# Altium schematic sheet Sheet1.SchDoc
size A
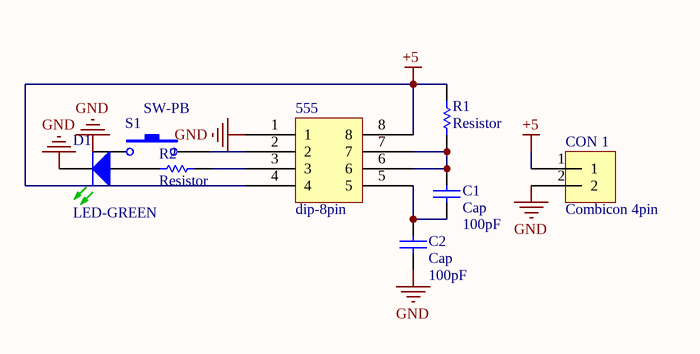
[diagram p0: Sheet1.SchDoc]

## Parts
555  dip-8pin  [dip-8pin]
C1  Cap  value 100pF  [CAP]
C2  Cap  value 100pF  [CAP]
CON_1  Combicon 4pin  [combicon-2pin_black]
D1  LED-GREEN  [LED-GREEN]
R1  Resistor  [res-2.54x4]
R2  Resistor  [res-2.54x5]
S1  SW-PB  [sw-pb]

## Nets
+5: 555.4 555.8 CON_1.1 R1.2  [also labelled +5 ]
GND: 555.1 C2.2 CON_1.2 D1.2(K) S1.1
Net555_2: 555.2 S1.2
Net555_3: 555.3 R2.2
Net555_5: 555.5 C1.1 C2.1
Net555_6: 555.6 555.7 C1.2 R1.1
NetD1_1: D1.1(A) R2.1

## Library data of the parts
C1 C2 = Cap: Capacitor; Published: 8-Jun-2000; LatestRevisionDate: 17-Jul-2002; LatestRevisionNote: Re-released for DXP Platform.; PackageReference: RAD-0.3; Publisher: Altium Limited
CON_1 = Combicon - 2 pin_black
D1 = LED-GREEN: Typical RED GaAs LED; Published: 8-Jun-2000; LatestRevisionDate: 08-Jul-2005; LatestRevisionNote: Mech Layer 1 removed.; PackageReference: LED-1; Publisher: Altium Limited
R1 = Resistor 2.54x4
R2 = Resistor 2.54x5
S1 = SW-PB: Switch; Published: 24-Mar-1999; LatestRevisionDate: 17-Jul-2002; LatestRevisionNote: Re-released for DXP Platform.; PackageReference: SPST-2; Publisher: Altium Limited